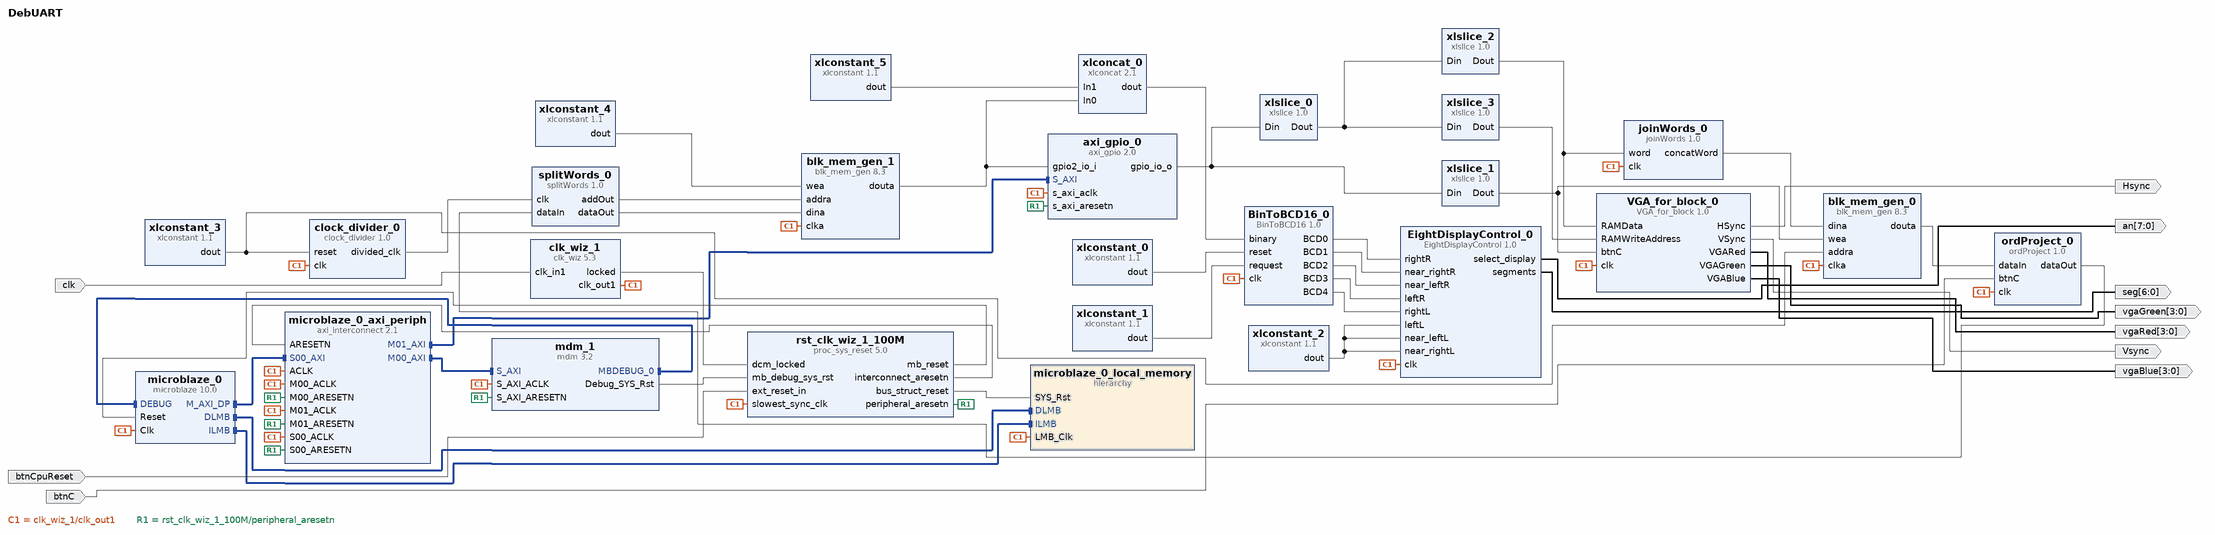
[diagram p0: block diagram of the top level]
# Vivado block design DebUART, xc7a100tcsg324-1, Vivado 2016.4
create_bd_design DebUART

create_bd_port -dir I btnCpuReset
create_bd_port -dir I clk
create_bd_port -dir O -from 7 -to 0 an
create_bd_port -dir O -from 6 -to 0 seg
create_bd_port -dir I btnC
create_bd_port -dir O Hsync
create_bd_port -dir O Vsync
create_bd_port -dir O -from 3 -to 0 vgaRed
create_bd_port -dir O -from 3 -to 0 vgaGreen
create_bd_port -dir O -from 3 -to 0 vgaBlue

create_bd_cell -type ip -vlnv xilinx.com:ip:microblaze:10.0 microblaze_0
set_property -dict {CONFIG.C_D_AXI 1 CONFIG.C_D_LMB 1 CONFIG.C_I_LMB 1 CONFIG.C_DEBUG_ENABLED 1} [get_bd_cells microblaze_0]
create_bd_cell -type hier microblaze_0_local_memory
create_bd_cell -type ip -vlnv xilinx.com:ip:axi_interconnect:2.1 microblaze_0_axi_periph
set_property -dict {CONFIG.NUM_MI 2} [get_bd_cells microblaze_0_axi_periph]
create_bd_cell -type ip -vlnv xilinx.com:ip:mdm:3.2 mdm_1
set_property -dict {CONFIG.C_USE_UART 1} [get_bd_cells mdm_1]
create_bd_cell -type ip -vlnv xilinx.com:ip:clk_wiz:5.3 clk_wiz_1
set_property -dict {CONFIG.PRIM_SOURCE Single_ended_clock_capable_pin} [get_bd_cells clk_wiz_1]
create_bd_cell -type ip -vlnv xilinx.com:ip:proc_sys_reset:5.0 rst_clk_wiz_1_100M
create_bd_cell -type ip -vlnv xilinx.com:ip:axi_gpio:2.0 axi_gpio_0
set_property -dict [list \
  CONFIG.C_GPIO_WIDTH 22 \
  CONFIG.C_GPIO2_WIDTH 8 \
  CONFIG.C_IS_DUAL 1 \
  CONFIG.C_ALL_INPUTS_2 1 \
  CONFIG.C_ALL_OUTPUTS 1 \
] [get_bd_cells axi_gpio_0]
create_bd_cell -type ip -vlnv xilinx.com:ip:xlconstant:1.1 xlconstant_0
set_property -dict {CONFIG.CONST_VAL 0} [get_bd_cells xlconstant_0]
create_bd_cell -type ip -vlnv xilinx.com:ip:xlconstant:1.1 xlconstant_1
create_bd_cell -type ip -vlnv xilinx.com:ip:xlconstant:1.1 xlconstant_2
set_property -dict {CONFIG.CONST_WIDTH 4 CONFIG.CONST_VAL 0} [get_bd_cells xlconstant_2]
create_bd_cell -type ip -vlnv xilinx.com:ip:xlconstant:1.1 xlconstant_3
set_property -dict {CONFIG.CONST_VAL 0} [get_bd_cells xlconstant_3]
create_bd_cell -type ip -vlnv xilinx.com:user:clock_divider:1.0 clock_divider_0
set_property -dict {CONFIG.how_fast 26} [get_bd_cells clock_divider_0]
create_bd_cell -type ip -vlnv xilinx.com:ip:xlconstant:1.1 xlconstant_5
set_property -dict {CONFIG.CONST_WIDTH 8 CONFIG.CONST_VAL 0} [get_bd_cells xlconstant_5]
create_bd_cell -type ip -vlnv xilinx.com:ip:xlconcat:2.1 xlconcat_0
set_property -dict {CONFIG.IN0_WIDTH 8 CONFIG.IN1_WIDTH 8} [get_bd_cells xlconcat_0]
create_bd_cell -type ip -vlnv xilinx.com:user:BinToBCD16:1.0 BinToBCD16_0
create_bd_cell -type ip -vlnv xilinx.com:user:EightDisplayControl:1.0 EightDisplayControl_0
create_bd_cell -type ip -vlnv xilinx.com:user:ordProject:1.0 ordProject_0
set_property -dict {CONFIG.number_of_words 64} [get_bd_cells ordProject_0]
create_bd_cell -type ip -vlnv xilinx.com:ip:xlslice:1.0 xlslice_0
set_property -dict {CONFIG.DOUT_WIDTH 21 CONFIG.DIN_TO 0 CONFIG.DIN_FROM 20 CONFIG.DIN_WIDTH 22} [get_bd_cells xlslice_0]
create_bd_cell -type ip -vlnv xilinx.com:ip:xlslice:1.0 xlslice_1
set_property -dict {CONFIG.DOUT_WIDTH 1 CONFIG.DIN_TO 21 CONFIG.DIN_FROM 21 CONFIG.DIN_WIDTH 22} [get_bd_cells xlslice_1]
create_bd_cell -type ip -vlnv xilinx.com:user:VGA_for_block:1.0 VGA_for_block_0
create_bd_cell -type ip -vlnv xilinx.com:ip:xlslice:1.0 xlslice_2
set_property -dict {CONFIG.DOUT_WIDTH 8 CONFIG.DIN_TO 0 CONFIG.DIN_FROM 7 CONFIG.DIN_WIDTH 21} [get_bd_cells xlslice_2]
create_bd_cell -type ip -vlnv xilinx.com:ip:xlslice:1.0 xlslice_3
set_property -dict {CONFIG.DOUT_WIDTH 13 CONFIG.DIN_TO 8 CONFIG.DIN_FROM 20 CONFIG.DIN_WIDTH 21} [get_bd_cells xlslice_3]
create_bd_cell -type ip -vlnv xilinx.com:ip:blk_mem_gen:8.3 blk_mem_gen_0
set_property -dict [list \
  CONFIG.Enable_32bit_Address false \
  CONFIG.Use_Byte_Write_Enable false \
  CONFIG.Write_Width_A 512 \
  CONFIG.Read_Width_A 512 \
  CONFIG.Enable_A Always_Enabled \
  CONFIG.Register_PortA_Output_of_Memory_Primitives false \
  CONFIG.Use_RSTA_Pin false \
  CONFIG.use_bram_block Stand_Alone \
] [get_bd_cells blk_mem_gen_0]
create_bd_cell -type ip -vlnv xilinx.com:user:joinWords:1.0 joinWords_0
set_property -dict {CONFIG.nr_words 64} [get_bd_cells joinWords_0]
create_bd_cell -type ip -vlnv xilinx.com:ip:blk_mem_gen:8.3 blk_mem_gen_1
set_property -dict [list \
  CONFIG.Enable_32bit_Address false \
  CONFIG.Use_Byte_Write_Enable false \
  CONFIG.Write_Width_A 8 \
  CONFIG.Read_Width_A 8 \
  CONFIG.Enable_A Always_Enabled \
  CONFIG.Register_PortA_Output_of_Memory_Primitives false \
  CONFIG.Use_RSTA_Pin false \
  CONFIG.use_bram_block Stand_Alone \
] [get_bd_cells blk_mem_gen_1]
create_bd_cell -type ip -vlnv xilinx.com:ip:xlconstant:1.1 xlconstant_4
create_bd_cell -type ip -vlnv xilinx.com:user:splitWords:1.0 splitWords_0
set_property -dict {CONFIG.n_words 64} [get_bd_cells splitWords_0]

# ---- hierarchy /microblaze_0_local_memory ----
current_bd_instance /microblaze_0_local_memory
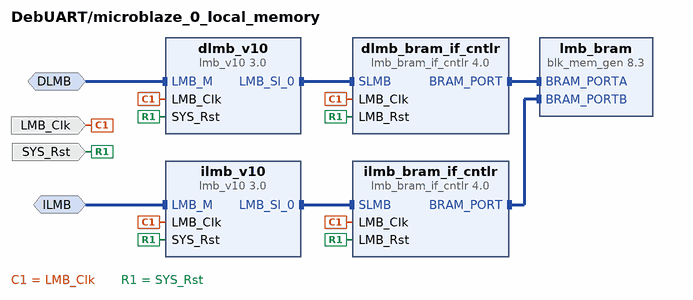
[diagram p1: block diagram inside /microblaze_0_local_memory]
create_bd_intf_pin -mode MirroredMaster -vlnv xilinx.com:interface:lmb_rtl:1.0 DLMB
create_bd_intf_pin -mode MirroredMaster -vlnv xilinx.com:interface:lmb_rtl:1.0 ILMB
create_bd_pin -dir I -type clk LMB_Clk
create_bd_pin -dir I -type rst SYS_Rst

create_bd_cell -type ip -vlnv xilinx.com:ip:lmb_v10:3.0 dlmb_v10
create_bd_cell -type ip -vlnv xilinx.com:ip:lmb_v10:3.0 ilmb_v10
create_bd_cell -type ip -vlnv xilinx.com:ip:lmb_bram_if_cntlr:4.0 dlmb_bram_if_cntlr
set_property -dict {CONFIG.C_ECC 0} [get_bd_cells dlmb_bram_if_cntlr]
create_bd_cell -type ip -vlnv xilinx.com:ip:lmb_bram_if_cntlr:4.0 ilmb_bram_if_cntlr
set_property -dict {CONFIG.C_ECC 0} [get_bd_cells ilmb_bram_if_cntlr]
create_bd_cell -type ip -vlnv xilinx.com:ip:blk_mem_gen:8.3 lmb_bram
set_property -dict {CONFIG.Memory_Type True_Dual_Port_RAM CONFIG.use_bram_block BRAM_Controller} [get_bd_cells lmb_bram]

# ---- connections ----

current_bd_instance /microblaze_0_local_memory
connect_bd_intf_net -intf_net microblaze_0_dlmb_bus [get_bd_intf_pins dlmb_v10/LMB_Sl_0] [get_bd_intf_pins dlmb_bram_if_cntlr/SLMB]
connect_bd_intf_net -intf_net microblaze_0_ilmb_bus [get_bd_intf_pins ilmb_v10/LMB_Sl_0] [get_bd_intf_pins ilmb_bram_if_cntlr/SLMB]
connect_bd_intf_net -intf_net microblaze_0_dlmb_cntlr [get_bd_intf_pins dlmb_bram_if_cntlr/BRAM_PORT] [get_bd_intf_pins lmb_bram/BRAM_PORTA]
connect_bd_intf_net -intf_net microblaze_0_ilmb_cntlr [get_bd_intf_pins ilmb_bram_if_cntlr/BRAM_PORT] [get_bd_intf_pins lmb_bram/BRAM_PORTB]
connect_bd_intf_net -intf_net microblaze_0_dlmb [get_bd_intf_pins DLMB] [get_bd_intf_pins dlmb_v10/LMB_M]
connect_bd_intf_net -intf_net microblaze_0_ilmb [get_bd_intf_pins ILMB] [get_bd_intf_pins ilmb_v10/LMB_M]
connect_bd_net -net microblaze_0_Clk [get_bd_pins LMB_Clk] \
  [get_bd_pins dlmb_v10/LMB_Clk] [get_bd_pins dlmb_bram_if_cntlr/LMB_Clk] [get_bd_pins ilmb_v10/LMB_Clk] \
  [get_bd_pins ilmb_bram_if_cntlr/LMB_Clk]
connect_bd_net [get_bd_pins SYS_Rst] \
  [get_bd_pins dlmb_v10/SYS_Rst] [get_bd_pins dlmb_bram_if_cntlr/LMB_Rst] [get_bd_pins ilmb_v10/SYS_Rst] \
  [get_bd_pins ilmb_bram_if_cntlr/LMB_Rst]

current_bd_instance /
connect_bd_intf_net [get_bd_intf_pins microblaze_0/DLMB] [get_bd_intf_pins microblaze_0_local_memory/DLMB]
connect_bd_intf_net [get_bd_intf_pins microblaze_0/ILMB] [get_bd_intf_pins microblaze_0_local_memory/ILMB]
connect_bd_intf_net -intf_net microblaze_0_axi_dp [get_bd_intf_pins microblaze_0_axi_periph/S00_AXI] [get_bd_intf_pins microblaze_0/M_AXI_DP]
connect_bd_intf_net [get_bd_intf_pins mdm_1/MBDEBUG_0] [get_bd_intf_pins microblaze_0/DEBUG]
connect_bd_intf_net -intf_net microblaze_0_mdm_axi [get_bd_intf_pins microblaze_0_axi_periph/M00_AXI] [get_bd_intf_pins mdm_1/S_AXI]
connect_bd_intf_net [get_bd_intf_pins microblaze_0_axi_periph/M01_AXI] [get_bd_intf_pins axi_gpio_0/S_AXI]
connect_bd_net -net microblaze_0_Clk [get_bd_pins clk_wiz_1/clk_out1] \
  [get_bd_pins microblaze_0/Clk] [get_bd_pins mdm_1/S_AXI_ACLK] [get_bd_pins rst_clk_wiz_1_100M/slowest_sync_clk] \
  [get_bd_pins axi_gpio_0/s_axi_aclk] [get_bd_pins clock_divider_0/clk] [get_bd_pins BinToBCD16_0/clk] \
  [get_bd_pins EightDisplayControl_0/clk] [get_bd_pins ordProject_0/clk] [get_bd_pins VGA_for_block_0/clk] \
  [get_bd_pins blk_mem_gen_0/clka] [get_bd_pins joinWords_0/clk] [get_bd_pins blk_mem_gen_1/clka] \
  [get_bd_pins microblaze_0_axi_periph/ACLK] [get_bd_pins microblaze_0_axi_periph/S00_ACLK] \
  [get_bd_pins microblaze_0_axi_periph/M00_ACLK] [get_bd_pins microblaze_0_local_memory/LMB_Clk] \
  [get_bd_pins microblaze_0_axi_periph/M01_ACLK]
connect_bd_net [get_bd_pins clk_wiz_1/locked] [get_bd_pins rst_clk_wiz_1_100M/dcm_locked]
connect_bd_net [get_bd_pins rst_clk_wiz_1_100M/mb_reset] [get_bd_pins microblaze_0/Reset]
connect_bd_net [get_bd_pins rst_clk_wiz_1_100M/bus_struct_reset] [get_bd_pins microblaze_0_local_memory/SYS_Rst]
connect_bd_net [get_bd_pins rst_clk_wiz_1_100M/interconnect_aresetn] [get_bd_pins microblaze_0_axi_periph/ARESETN]
connect_bd_net [get_bd_pins rst_clk_wiz_1_100M/peripheral_aresetn] \
  [get_bd_pins mdm_1/S_AXI_ARESETN] [get_bd_pins axi_gpio_0/s_axi_aresetn] [get_bd_pins microblaze_0_axi_periph/S00_ARESETN] \
  [get_bd_pins microblaze_0_axi_periph/M00_ARESETN] [get_bd_pins microblaze_0_axi_periph/M01_ARESETN]
connect_bd_net [get_bd_pins mdm_1/Debug_SYS_Rst] [get_bd_pins rst_clk_wiz_1_100M/mb_debug_sys_rst]
connect_bd_net [get_bd_ports btnCpuReset] [get_bd_pins rst_clk_wiz_1_100M/ext_reset_in]
connect_bd_net [get_bd_ports clk] [get_bd_pins clk_wiz_1/clk_in1]
connect_bd_net [get_bd_pins xlconstant_3/dout] [get_bd_pins clock_divider_0/reset] [get_bd_pins blk_mem_gen_0/addra]
connect_bd_net [get_bd_pins xlconstant_5/dout] [get_bd_pins xlconcat_0/In1]
connect_bd_net -net valuesSorted_0_dataOut [get_bd_pins blk_mem_gen_1/douta] [get_bd_pins xlconcat_0/In0] [get_bd_pins axi_gpio_0/gpio2_io_i]
connect_bd_net [get_bd_pins BinToBCD16_0/BCD0] [get_bd_pins EightDisplayControl_0/rightR]
connect_bd_net [get_bd_pins BinToBCD16_0/BCD1] [get_bd_pins EightDisplayControl_0/near_rightR]
connect_bd_net [get_bd_pins BinToBCD16_0/BCD2] [get_bd_pins EightDisplayControl_0/near_leftR]
connect_bd_net [get_bd_pins BinToBCD16_0/BCD3] [get_bd_pins EightDisplayControl_0/leftR]
connect_bd_net [get_bd_pins BinToBCD16_0/BCD4] [get_bd_pins EightDisplayControl_0/rightL]
connect_bd_net [get_bd_pins xlconstant_2/dout] \
  [get_bd_pins EightDisplayControl_0/leftL] [get_bd_pins EightDisplayControl_0/near_leftL] \
  [get_bd_pins EightDisplayControl_0/near_rightL]
connect_bd_net [get_bd_pins xlconstant_0/dout] [get_bd_pins BinToBCD16_0/reset]
connect_bd_net [get_bd_pins xlconstant_1/dout] [get_bd_pins BinToBCD16_0/request]
connect_bd_net [get_bd_pins xlconcat_0/dout] [get_bd_pins BinToBCD16_0/binary]
connect_bd_net [get_bd_pins EightDisplayControl_0/select_display] [get_bd_ports an]
connect_bd_net [get_bd_pins EightDisplayControl_0/segments] [get_bd_ports seg]
connect_bd_net [get_bd_ports btnC] [get_bd_pins ordProject_0/btnC]
connect_bd_net [get_bd_pins axi_gpio_0/gpio_io_o] [get_bd_pins xlslice_0/Din] [get_bd_pins xlslice_1/Din]
connect_bd_net [get_bd_pins VGA_for_block_0/HSync] [get_bd_ports Hsync]
connect_bd_net [get_bd_pins VGA_for_block_0/VSync] [get_bd_ports Vsync]
connect_bd_net [get_bd_pins VGA_for_block_0/VGARed] [get_bd_ports vgaRed]
connect_bd_net [get_bd_pins VGA_for_block_0/VGAGreen] [get_bd_ports vgaGreen]
connect_bd_net [get_bd_pins VGA_for_block_0/VGABlue] [get_bd_ports vgaBlue]
connect_bd_net [get_bd_pins xlslice_2/Dout] [get_bd_pins VGA_for_block_0/RAMData] [get_bd_pins joinWords_0/word]
connect_bd_net [get_bd_pins xlslice_3/Dout] [get_bd_pins VGA_for_block_0/RAMWriteAddress]
connect_bd_net [get_bd_pins blk_mem_gen_0/douta] [get_bd_pins ordProject_0/dataIn]
connect_bd_net [get_bd_pins xlslice_0/Dout] [get_bd_pins xlslice_2/Din] [get_bd_pins xlslice_3/Din]
connect_bd_net [get_bd_pins xlslice_1/Dout] [get_bd_pins blk_mem_gen_0/wea] [get_bd_pins VGA_for_block_0/btnC]
connect_bd_net [get_bd_pins joinWords_0/concatWord] [get_bd_pins blk_mem_gen_0/dina]
connect_bd_net [get_bd_pins xlconstant_4/dout] [get_bd_pins blk_mem_gen_1/wea]
connect_bd_net [get_bd_pins clock_divider_0/divided_clk] [get_bd_pins splitWords_0/clk]
connect_bd_net [get_bd_pins ordProject_0/dataOut] [get_bd_pins splitWords_0/dataIn]
connect_bd_net [get_bd_pins splitWords_0/addOut] [get_bd_pins blk_mem_gen_1/addra]
connect_bd_net [get_bd_pins splitWords_0/dataOut] [get_bd_pins blk_mem_gen_1/dina]

# ---- address map ----
assign_bd_address -offset 0x00000000 -range 32K -target_address_space [get_bd_addr_spaces microblaze_0/Data] [get_bd_addr_segs microblaze_0_local_memory/dlmb_bram_if_cntlr/SLMB/Mem]
assign_bd_address -offset 0x40000000 -range 64K -target_address_space [get_bd_addr_spaces microblaze_0/Data] [get_bd_addr_segs axi_gpio_0/S_AXI/Reg]
assign_bd_address -offset 0x41400000 -range 16K -target_address_space [get_bd_addr_spaces microblaze_0/Data] [get_bd_addr_segs mdm_1/S_AXI/Reg]
assign_bd_address -offset 0x00000000 -range 32K -target_address_space [get_bd_addr_spaces microblaze_0/Instruction] [get_bd_addr_segs microblaze_0_local_memory/ilmb_bram_if_cntlr/SLMB/Mem]

validate_bd_design
save_bd_design
